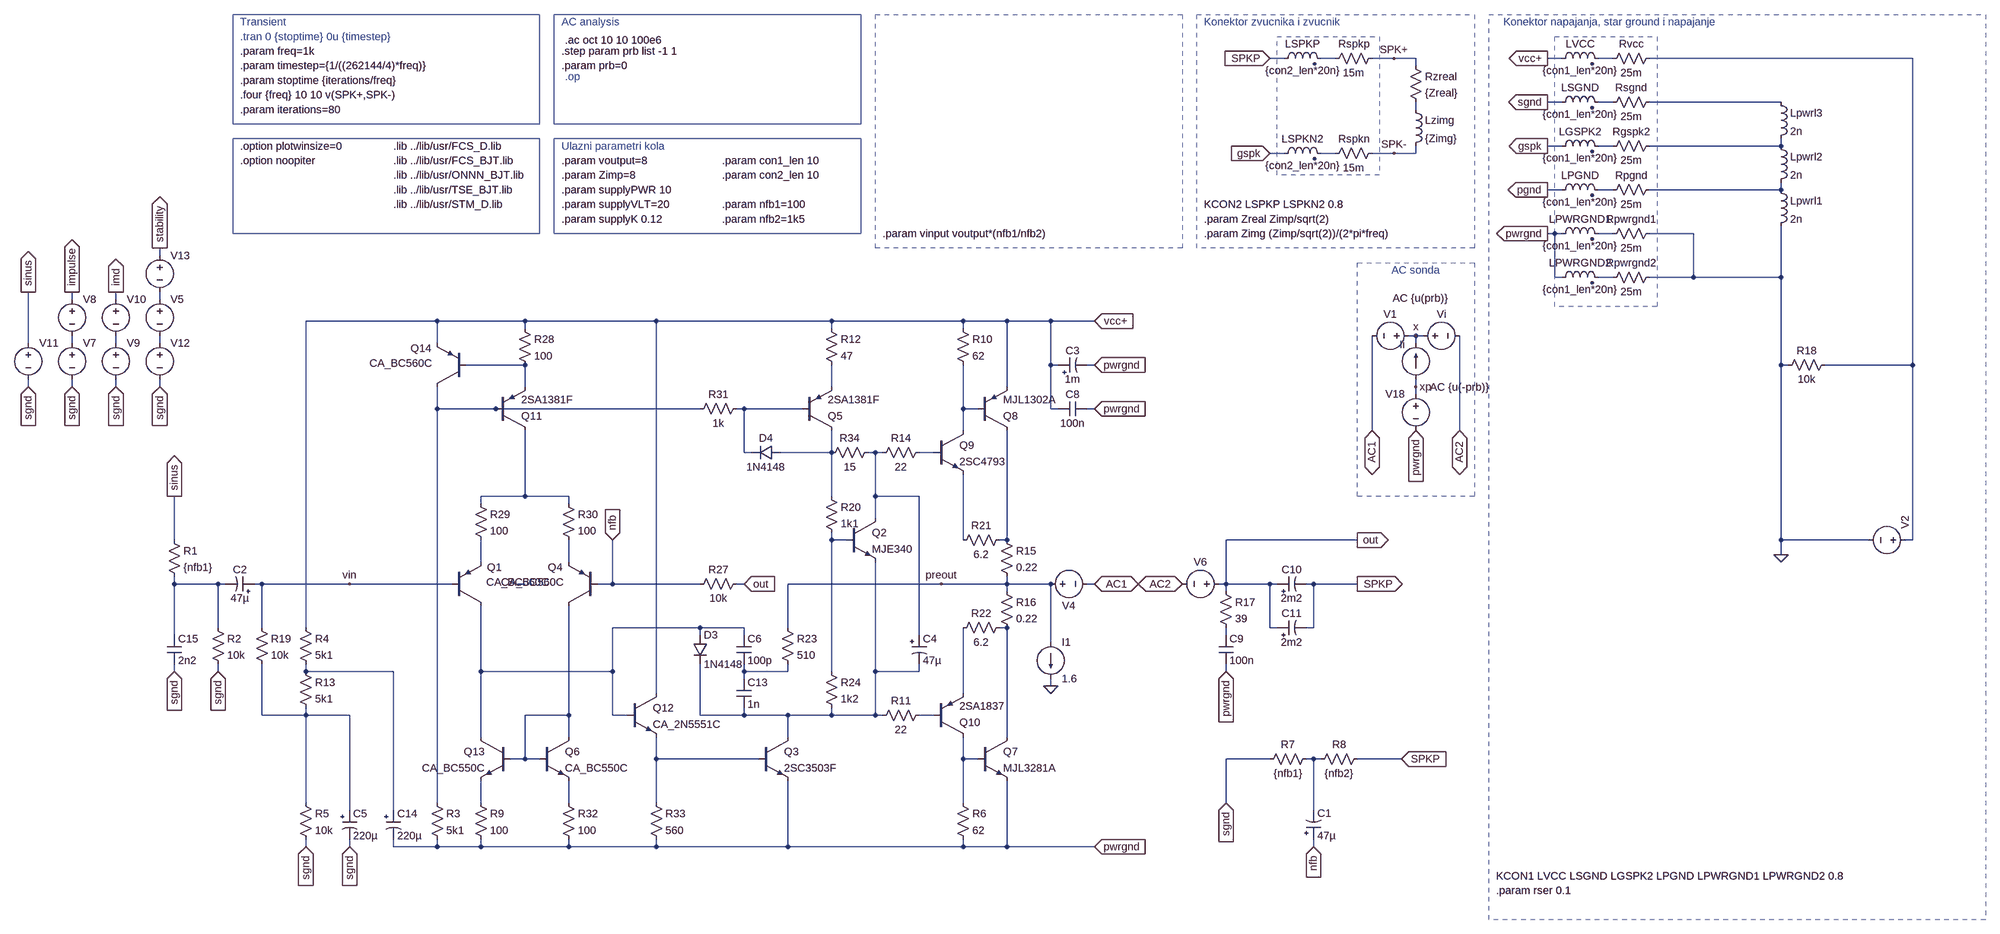
[diagram p0: schematic pab3bbb-compact.asc]
pab3bbb-compact.asc, the LTspice schematic file:
Version 4
SHEET 1 6124 2336
WIRE 2272 -1536 2240 -1536
WIRE 2384 -1536 2352 -1536
WIRE 2512 -1536 2464 -1536
WIRE 2560 -1536 2512 -1536
WIRE 2880 -1536 2848 -1536
WIRE 2992 -1536 2960 -1536
WIRE 3648 -1536 3072 -1536
WIRE 2560 -1520 2560 -1536
WIRE 2880 -1440 2848 -1440
WIRE 2992 -1440 2960 -1440
WIRE 3360 -1440 3072 -1440
WIRE 2560 -1424 2560 -1440
WIRE 2880 -1344 2848 -1344
WIRE 2992 -1344 2960 -1344
WIRE 3360 -1344 3360 -1360
WIRE 3360 -1344 3072 -1344
WIRE 2272 -1328 2240 -1328
WIRE 2384 -1328 2352 -1328
WIRE 2512 -1328 2464 -1328
WIRE 2560 -1328 2560 -1344
WIRE 2560 -1328 2512 -1328
WIRE 2880 -1248 2848 -1248
WIRE 2992 -1248 2960 -1248
WIRE 3360 -1248 3360 -1264
WIRE 3360 -1248 3072 -1248
WIRE 2864 -1152 2848 -1152
WIRE 2880 -1152 2864 -1152
WIRE 2992 -1152 2960 -1152
WIRE 3168 -1152 3072 -1152
WIRE -192 -1104 -192 -1120
WIRE 2864 -1056 2864 -1152
WIRE 2880 -1056 2864 -1056
WIRE 2992 -1056 2960 -1056
WIRE 3168 -1056 3168 -1152
WIRE 3168 -1056 3072 -1056
WIRE 3360 -1056 3360 -1168
WIRE 3360 -1056 3168 -1056
WIRE -384 -1008 -384 -1024
WIRE -288 -1008 -288 -1024
WIRE -192 -1008 -192 -1024
WIRE 416 -960 128 -960
WIRE 608 -960 416 -960
WIRE 896 -960 608 -960
WIRE 1280 -960 896 -960
WIRE 1568 -960 1280 -960
WIRE 1664 -960 1568 -960
WIRE 1760 -960 1664 -960
WIRE 1856 -960 1760 -960
WIRE 608 -944 608 -960
WIRE 1280 -944 1280 -960
WIRE 1568 -944 1568 -960
WIRE 2560 -928 2544 -928
WIRE 2576 -928 2560 -928
WIRE -480 -912 -480 -1024
WIRE -384 -912 -384 -928
WIRE -288 -912 -288 -928
WIRE -192 -912 -192 -928
WIRE 416 -912 416 -960
WIRE 2560 -912 2560 -928
WIRE 608 -864 480 -864
WIRE 1760 -864 1760 -960
WIRE 1776 -864 1760 -864
WIRE 1856 -864 1840 -864
WIRE 3360 -864 3360 -1056
WIRE 3376 -864 3360 -864
WIRE 3648 -864 3648 -1536
WIRE 3648 -864 3456 -864
WIRE -480 -816 -480 -832
WIRE -384 -816 -384 -832
WIRE -288 -816 -288 -832
WIRE -192 -816 -192 -832
WIRE 608 -816 608 -864
WIRE 1280 -816 1280 -864
WIRE 1664 -816 1664 -960
WIRE 2560 -816 2560 -832
WIRE 2560 -800 2560 -816
WIRE 416 -768 416 -816
WIRE 544 -768 416 -768
WIRE 992 -768 544 -768
WIRE 1088 -768 1072 -768
WIRE 1216 -768 1088 -768
WIRE 1568 -768 1568 -864
WIRE 1600 -768 1568 -768
WIRE 1760 -768 1760 -864
WIRE 1776 -768 1760 -768
WIRE 1856 -768 1840 -768
WIRE 1568 -720 1568 -768
WIRE 2464 -720 2464 -928
WIRE 2656 -720 2656 -928
WIRE 1088 -672 1088 -768
WIRE 1104 -672 1088 -672
WIRE 1280 -672 1280 -720
WIRE 1280 -672 1168 -672
WIRE 1376 -672 1360 -672
WIRE 1392 -672 1376 -672
WIRE 1504 -672 1472 -672
WIRE 608 -576 608 -720
WIRE 608 -576 512 -576
WIRE 704 -576 608 -576
WIRE 1280 -576 1280 -672
WIRE 1376 -576 1376 -672
WIRE 1472 -576 1376 -576
WIRE 512 -560 512 -576
WIRE 704 -560 704 -576
WIRE 1376 -528 1376 -576
WIRE -160 -480 -160 -576
WIRE 1280 -480 1280 -496
WIRE 1312 -480 1280 -480
WIRE 1568 -480 1568 -624
WIRE 1664 -480 1664 -720
WIRE 1664 -480 1648 -480
WIRE 2432 -480 2144 -480
WIRE 3360 -480 3360 -864
WIRE 3552 -480 3360 -480
WIRE 3648 -480 3648 -864
WIRE 3648 -480 3632 -480
WIRE 3360 -448 3360 -480
WIRE 512 -432 512 -480
WIRE 704 -432 704 -480
WIRE -160 -384 -160 -400
WIRE -64 -384 -160 -384
WIRE -48 -384 -64 -384
WIRE 32 -384 16 -384
WIRE 224 -384 32 -384
WIRE 448 -384 224 -384
WIRE 608 -384 592 -384
WIRE 800 -384 800 -480
WIRE 800 -384 768 -384
WIRE 992 -384 800 -384
WIRE 1088 -384 1072 -384
WIRE 1520 -384 1184 -384
WIRE 1664 -384 1664 -400
WIRE 1664 -384 1520 -384
WIRE 1760 -384 1664 -384
WIRE 1856 -384 1840 -384
WIRE 2144 -384 2144 -480
WIRE 2144 -384 2128 -384
WIRE 2240 -384 2144 -384
WIRE 2256 -384 2240 -384
WIRE 2336 -384 2320 -384
WIRE 2432 -384 2336 -384
WIRE 1664 -368 1664 -384
WIRE 2144 -368 2144 -384
WIRE -64 -288 -64 -384
WIRE 32 -288 32 -384
WIRE 128 -288 128 -960
WIRE 992 -288 800 -288
WIRE 1088 -288 992 -288
WIRE 1184 -288 1184 -384
WIRE 1664 -288 1648 -288
WIRE 2240 -288 2240 -384
WIRE 2256 -288 2240 -288
WIRE 2336 -288 2336 -384
WIRE 2336 -288 2320 -288
WIRE -160 -272 -160 -384
WIRE 992 -272 992 -288
WIRE 1088 -272 1088 -288
WIRE 1472 -272 1472 -576
WIRE 2144 -272 2144 -288
WIRE 1760 -256 1760 -384
WIRE -160 -192 -160 -208
WIRE -64 -192 -64 -208
WIRE 128 -192 128 -208
WIRE 320 -192 128 -192
WIRE 512 -192 512 -336
WIRE 800 -192 800 -288
WIRE 800 -192 512 -192
WIRE 1088 -192 1088 -208
WIRE 1184 -192 1184 -208
WIRE 1184 -192 1088 -192
WIRE 1280 -192 1280 -480
WIRE 1376 -192 1376 -432
WIRE 1472 -192 1472 -208
WIRE 1472 -192 1376 -192
WIRE 2144 -192 2144 -208
WIRE 1088 -176 1088 -192
WIRE 1760 -160 1760 -176
WIRE 896 -144 896 -960
WIRE 1568 -144 1568 -288
WIRE 32 -96 32 -208
WIRE 128 -96 128 -112
WIRE 128 -96 32 -96
WIRE 224 -96 128 -96
WIRE 704 -96 704 -336
WIRE 704 -96 608 -96
WIRE 800 -96 800 -192
WIRE 832 -96 800 -96
WIRE 992 -96 992 -208
WIRE 1088 -96 1088 -112
WIRE 1088 -96 992 -96
WIRE 1184 -96 1088 -96
WIRE 1280 -96 1280 -112
WIRE 1280 -96 1184 -96
WIRE 1376 -96 1376 -192
WIRE 1376 -96 1280 -96
WIRE 1392 -96 1376 -96
WIRE 1504 -96 1472 -96
WIRE 512 -48 512 -192
WIRE 704 -48 704 -96
WIRE 1184 -48 1184 -96
WIRE 1664 -48 1664 -288
WIRE 608 0 608 -96
WIRE 608 0 576 0
WIRE 640 0 608 0
WIRE 896 0 896 -48
WIRE 1120 0 896 0
WIRE 1568 0 1568 -48
WIRE 1600 0 1568 0
WIRE 2240 0 2144 0
WIRE 2336 0 2320 0
WIRE 2352 0 2336 0
WIRE 2528 0 2432 0
WIRE 128 96 128 -96
WIRE 416 96 416 -768
WIRE 512 96 512 48
WIRE 704 96 704 48
WIRE 896 96 896 0
WIRE 1568 96 1568 0
WIRE 2144 96 2144 0
WIRE 224 112 224 -96
WIRE 320 112 320 -192
WIRE 2336 112 2336 0
WIRE 128 192 128 176
WIRE 224 192 224 176
WIRE 320 192 320 176
WIRE 416 192 416 176
WIRE 416 192 320 192
WIRE 512 192 512 176
WIRE 512 192 416 192
WIRE 704 192 704 176
WIRE 704 192 512 192
WIRE 896 192 896 176
WIRE 896 192 704 192
WIRE 1184 192 1184 48
WIRE 1184 192 896 192
WIRE 1568 192 1568 176
WIRE 1568 192 1184 192
WIRE 1664 192 1664 48
WIRE 1664 192 1568 192
WIRE 1856 192 1664 192
WIRE 2336 192 2336 176
FLAG 1856 -960 vcc+
IOPIN 1856 -960 In
FLAG 2560 -928 x
FLAG 2432 -480 out
IOPIN 2432 -480 Out
FLAG 2560 -816 xp
FLAG 2144 -192 pwrgnd
IOPIN 2144 -192 In
FLAG -480 -816 sgnd
IOPIN -480 -816 In
FLAG -480 -1024 sinus
IOPIN -480 -1024 Out
FLAG 2848 -1536 vcc+
IOPIN 2848 -1536 Out
FLAG 2848 -1344 gspk
IOPIN 2848 -1344 Out
FLAG 2848 -1248 pgnd
IOPIN 2848 -1248 Out
FLAG 2848 -1440 sgnd
IOPIN 2848 -1440 Out
FLAG 2432 -384 SPKP
IOPIN 2432 -384 Out
FLAG 2240 -1328 gspk
IOPIN 2240 -1328 In
FLAG 2240 -1536 SPKP
IOPIN 2240 -1536 In
FLAG 2848 -1152 pwrgnd
IOPIN 2848 -1152 Out
FLAG 3360 -448 0
FLAG 2464 -720 AC1
IOPIN 2464 -720 BiDir
FLAG 2656 -720 AC2
IOPIN 2656 -720 BiDir
FLAG 1856 -384 AC1
IOPIN 1856 -384 BiDir
FLAG 2048 -384 AC2
IOPIN 2048 -384 BiDir
FLAG 2560 -720 pwrgnd
IOPIN 2560 -720 In
FLAG 2512 -1536 SPK+
FLAG 2512 -1328 SPK-
FLAG -288 -1024 imd
IOPIN -288 -1024 Out
FLAG 1856 -768 pwrgnd
IOPIN 1856 -768 In
FLAG -384 -816 sgnd
IOPIN -384 -816 In
FLAG -288 -816 sgnd
IOPIN -288 -816 In
FLAG 1520 -384 preout
FLAG -64 -192 sgnd
IOPIN -64 -192 In
FLAG 1856 -864 pwrgnd
IOPIN 1856 -864 In
FLAG -192 -1120 stability
IOPIN -192 -1120 Out
FLAG -192 -816 sgnd
IOPIN -192 -816 In
FLAG 1856 192 pwrgnd
IOPIN 1856 192 In
FLAG -160 -192 sgnd
IOPIN -160 -192 In
FLAG 2144 96 sgnd
IOPIN 2144 96 In
FLAG -384 -1024 impulse
IOPIN -384 -1024 Out
FLAG 224 -384 vin
FLAG 2528 0 SPKP
IOPIN 2528 0 In
FLAG 1088 -384 out
IOPIN 1088 -384 In
FLAG -160 -576 sinus
IOPIN -160 -576 Out
FLAG 2336 192 nfb
IOPIN 2336 192 In
FLAG 800 -480 nfb
IOPIN 800 -480 In
FLAG 128 192 sgnd
IOPIN 128 192 In
FLAG 224 192 sgnd
IOPIN 224 192 In
FLAG 1760 -160 0
DATAFLAG 1488 -960 ""
DATAFLAG 1760 192 ""
DATAFLAG 1712 -384 ""
SYMBOL res 2224 16 R270
WINDOW 0 32 56 VTop 2
WINDOW 3 0 56 VBottom 2
SYMATTR InstName R7
SYMATTR Value {nfb1}
SYMBOL current 2560 -832 R180
WINDOW 0 24 77 Left 2
WINDOW 3 24 0 Invisible 2
WINDOW 123 -71 178 Left 2
WINDOW 39 0 0 Left 2
SYMATTR InstName Ii
SYMATTR Value 0
SYMATTR Value2 AC {u(prb)}
SYMBOL voltage 2560 -928 R270
WINDOW 0 32 56 VTop 2
WINDOW 3 -32 56 Invisible 2
WINDOW 123 -97 96 VBottom 2
WINDOW 39 -32 56 VBottom 2
SYMATTR InstName Vi
SYMATTR Value 0
SYMATTR Value2 AC {u(-prb)}
SYMBOL pnp 448 -336 M180
WINDOW 0 77 84 Left 2
WINDOW 3 75 52 Left 2
SYMATTR InstName Q1
SYMATTR Value CA_BC560C
SYMBOL res 496 80 R0
SYMATTR InstName R9
SYMATTR Value 100
SYMBOL res 2448 -16 R90
WINDOW 0 0 56 VBottom 2
WINDOW 3 32 56 VTop 2
SYMATTR InstName R8
SYMATTR Value {nfb2}
SYMBOL voltage 2560 -928 R90
WINDOW 0 -32 56 VBottom 2
WINDOW 3 32 56 Invisible 2
WINDOW 123 0 0 Left 2
WINDOW 39 0 0 Left 2
SYMATTR InstName V1
SYMATTR Value 0
SYMBOL res 2128 -384 R0
SYMATTR InstName R17
SYMATTR Value 39
SYMBOL res 2544 -1536 R0
SYMATTR InstName Rzreal
SYMATTR Value {Zreal}
SYMBOL ind 2544 -1440 R0
SYMATTR InstName Lzimg
SYMATTR Value {Zimg}
SYMATTR SpiceLine Cpar=10p
SYMBOL voltage 2560 -816 M0
WINDOW 123 0 0 Left 2
WINDOW 39 0 0 Left 2
WINDOW 3 24 96 Invisible 2
SYMATTR Value 0
SYMATTR InstName V18
SYMBOL cap 1776 -784 M90
WINDOW 0 0 32 VBottom 2
WINDOW 3 32 32 VTop 2
SYMATTR InstName C8
SYMATTR Value 100n
SYMATTR SpiceLine Rser=300m Lser=3n Rpar=4.4meg Cpar=1p
SYMBOL cap 2128 -272 R0
SYMATTR InstName C9
SYMATTR Value 100n
SYMATTR SpiceLine Rser=700m Lser=7n Rpar=4.4meg Cpar=1p
SYMBOL ind2 2864 -1520 R270
WINDOW 0 32 56 VTop 2
WINDOW 3 5 56 VBottom 2
SYMATTR InstName LVCC
SYMATTR Value {con1_len*20n}
SYMATTR SpiceLine Rser={con1_len*.5m}
SYMATTR Type ind
SYMBOL voltage -480 -928 R0
WINDOW 123 24 44 Left 2
WINDOW 39 0 0 Left 2
WINDOW 3 24 96 Invisible 2
SYMATTR Value SINE(0 {vinput} {freq} 0 0 0)
SYMATTR InstName V11
SYMBOL ind2 2864 -1328 R270
WINDOW 0 32 56 VTop 2
WINDOW 3 5 56 VBottom 2
SYMATTR InstName LGSPK2
SYMATTR Value {con1_len*20n}
SYMATTR SpiceLine Rser={con1_len*.5m}
SYMATTR Type ind
SYMBOL ind2 2864 -1040 R270
WINDOW 0 32 56 VTop 2
WINDOW 3 5 56 VBottom 2
SYMATTR InstName LPWRGND2
SYMATTR Value {con1_len*20n}
SYMATTR SpiceLine Rser={con1_len*.5m}
SYMATTR Type ind
SYMBOL ind2 2864 -1232 R270
WINDOW 0 32 56 VTop 2
WINDOW 3 5 56 VBottom 2
SYMATTR InstName LPGND
SYMATTR Value {con1_len*20n}
SYMATTR SpiceLine Rser={con1_len*.5m}
SYMATTR Type ind
SYMBOL ind2 2864 -1424 R270
WINDOW 0 32 56 VTop 2
WINDOW 3 5 56 VBottom 2
SYMATTR InstName LSGND
SYMATTR Value {con1_len*20n}
SYMATTR SpiceLine Rser={con1_len*.5m}
SYMATTR Type ind
SYMBOL res 3088 -1552 R90
WINDOW 0 0 56 VBottom 2
WINDOW 3 32 56 VTop 2
SYMATTR InstName Rvcc
SYMATTR Value 25m
SYMBOL res 3088 -1360 R90
WINDOW 0 0 56 VBottom 2
WINDOW 3 32 56 VTop 2
SYMATTR InstName Rgspk2
SYMATTR Value 25m
SYMBOL res 3088 -1072 R90
WINDOW 0 0 56 VBottom 2
WINDOW 3 32 56 VTop 2
SYMATTR InstName Rpwrgnd2
SYMATTR Value 25m
SYMBOL res 3088 -1264 R90
WINDOW 0 0 56 VBottom 2
WINDOW 3 32 56 VTop 2
SYMATTR InstName Rpgnd
SYMATTR Value 25m
SYMBOL res 3088 -1456 R90
WINDOW 0 0 56 VBottom 2
WINDOW 3 32 56 VTop 2
SYMATTR InstName Rsgnd
SYMATTR Value 25m
SYMBOL ind 3344 -1264 R0
SYMATTR InstName Lpwrl1
SYMATTR Value 2n
SYMATTR SpiceLine Rser=1m
SYMBOL ind 3344 -1360 R0
SYMATTR InstName Lpwrl2
SYMATTR Value 2n
SYMATTR SpiceLine Rser=1m
SYMBOL ind 3344 -1456 R0
SYMATTR InstName Lpwrl3
SYMATTR Value 2n
SYMATTR SpiceLine Rser=1m
SYMBOL ind2 2256 -1520 R270
WINDOW 0 32 56 VTop 2
WINDOW 3 5 56 VBottom 2
SYMATTR InstName LSPKP
SYMATTR Value {con2_len*20n}
SYMATTR SpiceLine Rser={con2_len*.5m}
SYMATTR Type ind
SYMBOL ind2 2256 -1312 R270
WINDOW 0 32 56 VTop 2
WINDOW 3 5 56 VBottom 2
SYMATTR InstName LSPKN2
SYMATTR Value {con2_len*20n}
SYMATTR SpiceLine Rser={con2_len*.5m}
SYMATTR Type ind
SYMBOL res 2480 -1552 R90
WINDOW 0 0 56 VBottom 2
WINDOW 3 32 56 VTop 2
SYMATTR InstName Rspkp
SYMATTR Value 15m
SYMBOL res 2480 -1344 R90
WINDOW 0 0 56 VBottom 2
WINDOW 3 32 56 VTop 2
SYMATTR InstName Rspkn
SYMATTR Value 15m
SYMBOL ind2 2864 -1136 R270
WINDOW 0 32 56 VTop 2
WINDOW 3 5 56 VBottom 2
SYMATTR InstName LPWRGND1
SYMATTR Value {con1_len*20n}
SYMATTR SpiceLine Rser={con1_len*.5m}
SYMATTR Type ind
SYMBOL res 3088 -1168 R90
WINDOW 0 0 56 VBottom 2
WINDOW 3 32 56 VTop 2
SYMATTR InstName Rpwrgnd1
SYMATTR Value 25m
SYMBOL voltage -384 -928 R0
WINDOW 3 24 96 Invisible 2
WINDOW 123 0 0 Left 2
WINDOW 39 0 0 Left 2
SYMATTR Value PULSE(0 {vinput/2} 1u 1n 1n {1/(freq*2)} {1/freq})
SYMATTR InstName V7
SYMBOL voltage -384 -1024 R0
WINDOW 3 24 96 Invisible 2
WINDOW 123 0 0 Left 2
WINDOW 39 0 0 Left 2
SYMATTR Value PULSE(0 {-vinput/2} {1u+(1/(freq*2))} 1n 1n {1/(freq*2)} {1/freq})
SYMATTR InstName V8
SYMBOL polcap 16 -368 M270
WINDOW 3 0 32 VBottom 2
WINDOW 0 32 32 VTop 2
SYMATTR Value 47µ
SYMATTR InstName C2
SYMATTR SpiceLine V=6.3 Irms=290m Rser=0.5 Lser=3n Rpar=2100k Cpar=3p
SYMATTR Description Capacitor
SYMATTR Type cap
SYMBOL voltage 1744 -384 R270
WINDOW 0 -32 56 VBottom 2
WINDOW 3 32 56 Invisible 2
WINDOW 123 0 0 Left 2
WINDOW 39 0 0 Left 2
SYMATTR InstName V4
SYMATTR Value 0
SYMBOL voltage 2144 -384 R90
WINDOW 0 -32 56 VBottom 2
WINDOW 3 32 56 Invisible 2
WINDOW 123 0 0 Left 2
WINDOW 39 0 0 Left 2
SYMATTR InstName V6
SYMATTR Value 0
SYMBOL voltage -288 -928 R0
WINDOW 3 24 96 Invisible 2
WINDOW 123 0 0 Left 2
WINDOW 39 0 0 Left 2
SYMATTR Value SINE(0 {vinput/2} 19k)
SYMATTR InstName V9
SYMBOL voltage -288 -1024 R0
WINDOW 3 24 96 Invisible 2
WINDOW 123 0 0 Left 2
WINDOW 39 0 0 Left 2
SYMATTR Value SINE(0 {vinput/2} 20k 0 0)
SYMATTR InstName V10
SYMBOL res 1648 -384 R0
SYMATTR InstName R16
SYMATTR Value 0.22
SYMBOL res 1648 -496 R0
SYMATTR InstName R15
SYMATTR Value 0.22
SYMBOL npn 1120 -48 R0
SYMATTR InstName Q3
SYMATTR Value 2SC3503F
SYMBOL cap 1072 -272 R0
SYMATTR InstName C6
SYMATTR Value 100p
SYMATTR SpiceLine Rser=.3 Lser=6n Rpar=3.9meg Cpar=1p
SYMBOL res 3472 -880 R90
WINDOW 0 0 56 VBottom 2
WINDOW 3 32 56 VTop 2
SYMATTR InstName R18
SYMATTR Value 10k
SYMBOL voltage -192 -1120 R0
WINDOW 123 24 44 Left 2
WINDOW 39 0 0 Left 2
WINDOW 3 24 96 Invisible 2
SYMATTR Value SINE(0 {7*vinput/8} {freq} 0 0 0)
SYMATTR InstName V13
SYMBOL voltage -192 -1024 R0
WINDOW 3 24 96 Invisible 2
WINDOW 123 0 0 Left 2
WINDOW 39 0 0 Left 2
SYMATTR Value PULSE(0 {-vinput/8} {1u+(1/(freq*80))} 1n 1n {1/(freq*80)} {1/(freq*40)})
SYMATTR InstName V5
SYMBOL voltage -192 -928 R0
WINDOW 3 24 96 Invisible 2
WINDOW 123 0 0 Left 2
WINDOW 39 0 0 Left 2
SYMATTR Value PULSE(0 {vinput/8} 1u 1n 1n {1/(freq*80)} {1/(freq*40)})
SYMATTR InstName V12
SYMBOL res 1264 -960 R0
SYMATTR InstName R12
SYMATTR Value 47
SYMBOL res 1488 -688 R90
WINDOW 0 0 56 VBottom 2
WINDOW 3 32 56 VTop 2
SYMATTR InstName R14
SYMATTR Value 22
SYMBOL res 1488 -112 R90
WINDOW 0 0 56 VBottom 2
WINDOW 3 32 56 VTop 2
SYMATTR InstName R11
SYMATTR Value 22
SYMBOL voltage 3648 -480 M270
WINDOW 123 24 -12 Left 2
WINDOW 3 24 -12 Invisible 2
SYMATTR Value {supplyVLT}
SYMATTR SpiceLine Rser={rser}
SYMATTR InstName V2
SYMBOL polcap 2256 -368 R270
WINDOW 0 32 32 VTop 2
WINDOW 3 0 32 VBottom 2
SYMATTR InstName C10
SYMATTR Value 2m2
SYMATTR SpiceLine V=63 Irms=1.44 Rser=0.09 Lser=5.5n Rpar=3310k Cpar=3p
SYMATTR Description Capacitor
SYMATTR Type cap
SYMBOL res 112 80 R0
SYMATTR InstName R5
SYMATTR Value 10k
SYMBOL res 112 -304 R0
SYMATTR InstName R4
SYMATTR Value 5k1
SYMBOL res -80 -304 R0
SYMATTR InstName R2
SYMATTR Value 10k
SYMBOL polcap 2256 -272 R270
WINDOW 0 32 32 VTop 2
WINDOW 3 0 32 VBottom 2
SYMATTR InstName C11
SYMATTR Value 2m2
SYMATTR SpiceLine V=63 Irms=1.44 Rser=0.09 Lser=5.5n Rpar=3310k Cpar=3p
SYMATTR Description Capacitor
SYMATTR Type cap
SYMBOL res 1552 80 R0
SYMATTR InstName R6
SYMATTR Value 62
SYMBOL res 1552 -960 R0
SYMATTR InstName R10
SYMATTR Value 62
SYMBOL npn 1600 -48 R0
SYMATTR InstName Q7
SYMATTR Value MJL3281A
SYMBOL pnp 1600 -720 M180
SYMATTR InstName Q8
SYMATTR Value MJL1302A
SYMBOL npn 1504 -720 R0
SYMATTR InstName Q9
SYMATTR Value 2SC4793
SYMBOL pnp 1504 -48 M180
SYMATTR InstName Q10
SYMATTR Value 2SA1837
SYMBOL npn 1312 -528 R0
SYMATTR InstName Q2
SYMATTR Value MJE340
SYMBOL res 1264 -592 R0
SYMATTR InstName R20
SYMATTR Value 1k1
SYMBOL res 1264 -208 R0
SYMATTR InstName R24
SYMATTR Value 1k2
SYMBOL polcap 1456 -272 R0
SYMATTR Value 47µ
SYMATTR InstName C4
SYMATTR SpiceLine V=6.3 Irms=290m Rser=0.5 Lser=3n Rpar=2100k Cpar=3p
SYMATTR Description Capacitor
SYMATTR Type cap
SYMBOL res 1664 -496 R90
WINDOW 0 0 56 VBottom 2
WINDOW 3 32 56 VTop 2
SYMATTR InstName R21
SYMATTR Value 6.2
SYMBOL res 1664 -304 R90
WINDOW 0 0 56 VBottom 2
WINDOW 3 32 56 VTop 2
SYMATTR InstName R22
SYMATTR Value 6.2
SYMBOL pnp 1216 -720 M180
SYMATTR InstName Q5
SYMATTR Value 2SA1381F
SYMBOL polcap 208 112 R0
SYMATTR InstName C5
SYMATTR Value 220µ
SYMATTR SpiceLine V=6.3 Irms=1.44 Rser=0.09 Lser=5.5n Rpar=3310k Cpar=3p
SYMATTR Description Capacitor
SYMATTR Type cap
SYMBOL res 112 -208 R0
SYMATTR InstName R13
SYMATTR Value 5k1
SYMBOL polcap 304 112 R0
SYMATTR InstName C14
SYMATTR Value 220µ
SYMATTR SpiceLine V=6.3 Irms=1.44 Rser=0.09 Lser=5.5n Rpar=3310k Cpar=3p
SYMATTR Description Capacitor
SYMATTR Type cap
SYMBOL cap -176 -272 R0
SYMATTR InstName C15
SYMATTR Value 2n2
SYMATTR SpiceLine Rser=.3 Lser=6n Rpar=3.9meg Cpar=1p
SYMBOL pnp 768 -336 R180
WINDOW 0 77 84 Left 2
WINDOW 3 75 52 Left 2
SYMATTR InstName Q4
SYMATTR Value CA_BC560C
SYMBOL pnp 544 -720 M180
SYMATTR InstName Q11
SYMATTR Value 2SA1381F
SYMBOL res 592 -960 R0
SYMATTR InstName R28
SYMATTR Value 100
SYMBOL res 496 -576 R0
SYMATTR InstName R29
SYMATTR Value 100
SYMBOL res 688 -576 R0
SYMATTR InstName R30
SYMATTR Value 100
SYMBOL res 400 80 R0
SYMATTR InstName R3
SYMATTR Value 5k1
SYMBOL res 688 80 R0
SYMATTR InstName R32
SYMATTR Value 100
SYMBOL npn 832 -144 R0
SYMATTR InstName Q12
SYMATTR Value CA_2N5551C
SYMBOL res 880 80 R0
SYMATTR InstName R33
SYMATTR Value 560
SYMBOL res 1376 -688 R90
WINDOW 0 0 56 VBottom 2
WINDOW 3 32 56 VTop 2
SYMATTR InstName R34
SYMATTR Value 15
SYMBOL res -176 -496 R0
SYMATTR InstName R1
SYMATTR Value {nfb1}
SYMBOL res 16 -304 R0
SYMATTR InstName R19
SYMATTR Value 10k
SYMBOL res 1088 -400 R90
WINDOW 0 0 56 VBottom 2
WINDOW 3 32 56 VTop 2
SYMATTR InstName R27
SYMATTR Value 10k
SYMBOL res 1088 -784 R90
WINDOW 0 0 56 VBottom 2
WINDOW 3 32 56 VTop 2
SYMATTR InstName R31
SYMATTR Value 1k
SYMBOL npn 640 -48 R0
SYMATTR InstName Q6
SYMATTR Value CA_BC550C
SYMBOL npn 576 -48 M0
SYMATTR InstName Q13
SYMATTR Value CA_BC550C
SYMBOL diode 976 -272 R0
SYMATTR InstName D3
SYMATTR Value 1N4148
SYMBOL diode 1168 -688 R90
WINDOW 0 0 32 VBottom 2
WINDOW 3 32 32 VTop 2
SYMATTR InstName D4
SYMATTR Value 1N4148
SYMBOL cap 1072 -176 R0
SYMATTR InstName C13
SYMATTR Value 1n
SYMATTR SpiceLine Rser=.3 Lser=6n Rpar=3.9meg Cpar=1p
SYMBOL res 1168 -304 R0
SYMATTR InstName R23
SYMATTR Value 510
SYMBOL polcap 2320 176 M180
WINDOW 3 24 8 Left 2
WINDOW 0 24 57 Left 2
SYMATTR Value 47µ
SYMATTR InstName C1
SYMATTR SpiceLine V=6.3 Irms=290m Rser=0.5 Lser=3n Rpar=2100k Cpar=3p
SYMATTR Description Capacitor
SYMATTR Type cap
SYMBOL polcap 1776 -848 R270
WINDOW 0 32 32 VTop 2
WINDOW 3 0 32 VBottom 2
SYMATTR InstName C3
SYMATTR Value 1m
SYMATTR SpiceLine V=100 Irms=1.44 Rser=0.09 Lser=5.5n Rpar=3310k Cpar=3p
SYMATTR Description Capacitor
SYMATTR Type cap
SYMBOL pnp 480 -816 R180
WINDOW 0 77 84 Left 2
WINDOW 3 75 52 Left 2
SYMATTR InstName Q14
SYMATTR Value CA_BC560C
SYMBOL current 1760 -256 R0
WINDOW 123 0 0 Left 2
WINDOW 39 0 0 Left 2
SYMATTR InstName I1
SYMATTR Value 1.6
TEXT -16 -1344 Left 2 !.option plotwinsize=0
TEXT -16 -1312 Left 2 !.option noopiter
TEXT -16 -1616 Left 2 ;Transient
TEXT -16 -1456 Left 2 !.four {freq} 10 10 v(SPK+,SPK-)
TEXT 688 -1520 Left 2 !.param prb=0
TEXT -16 -1520 Left 2 !.param timestep={1/((262144/4)*freq)}
TEXT -16 -1552 Left 2 !.param freq=1k
TEXT -16 -1488 Left 2 !.param stoptime {iterations/freq}
TEXT 688 -1552 Left 2 !.step param prb list -1 1
TEXT 688 -1616 Left 2 ;AC analysis
TEXT -16 -1424 Left 2 !.param iterations=80
TEXT 320 -1280 Left 2 !.lib ../lib/usr/ONNN_BJT.lib
TEXT 688 -1280 Left 2 !.param Zimp=8
TEXT 2096 -1184 Left 2 !.param Zreal Zimp/sqrt(2)
TEXT 2096 -1152 Left 2 !.param Zimg (Zimp/sqrt(2))/(2*pi*freq)
TEXT 688 -1248 Left 2 !.param supplyPWR 10
TEXT 688 -1216 Left 2 !.param supplyVLT=20
TEXT 320 -1216 Left 2 !.lib ../lib/usr/STM_D.lib
TEXT 320 -1312 Left 2 !.lib ../lib/usr/FCS_BJT.lib
TEXT 688 -1312 Left 2 !.param voutput=8
TEXT 688 -1184 Left 2 !.param supplyK 0.12
TEXT 2736 288 Left 2 !.param rser 0.1
TEXT -16 -1584 Left 2 ;.tran 0 {stoptime} 0u {timestep}
TEXT 1040 -1312 Left 2 !.param con1_len 10
TEXT 2736 256 Left 2 !KCON1 LVCC LSGND LGSPK2 LPGND LPWRGND1 LPWRGND2 0.8
TEXT 1040 -1280 Left 2 !.param con2_len 10
TEXT 2096 -1216 Left 2 !KCON2 LSPKP LSPKN2 0.8
TEXT 2096 -1616 Left 2 ;Konektor zvucnika i zvucnik
TEXT 2752 -1616 Left 2 ;Konektor napajanja, star ground i napajanje
TEXT 688 -1344 Left 2 ;Ulazni parametri kola
TEXT 2560 -1072 Center 2 ;AC sonda
TEXT 320 -1344 Left 2 !.lib ../lib/usr/FCS_D.lib
TEXT 1392 -1152 Left 2 !.param vinput voutput*(nfb1/nfb2)
TEXT 1040 -1216 Left 2 !.param nfb1=100
TEXT 1040 -1184 Left 2 !.param nfb2=1k5
TEXT 696 -1496 Left 2 ;.op
TEXT 696 -1576 Left 2 !.ac oct 10 10 100e6
TEXT 320 -1248 Left 2 !.lib ../lib/usr/TSE_BJT.lib
RECTANGLE Normal 640 -1632 -32 -1392
RECTANGLE Normal 640 -1152 -32 -1360
RECTANGLE Normal 1344 -1632 672 -1392
RECTANGLE Normal 2688 -1120 2080 -1632 2
RECTANGLE Normal 2688 -576 2432 -1088 2
RECTANGLE Normal 3088 -992 2864 -1584 2
RECTANGLE Normal 2480 -1280 2256 -1584 2
RECTANGLE Normal 2048 -1120 1376 -1632 2
RECTANGLE Normal 1344 -1360 672 -1152
RECTANGLE Normal 3808 352 2720 -1632 2

The netlist it stands for:
* pab3bbb-compact.asc
R7 sgnd N046 {nfb1}
Ii xp x 0 AC {u(prb)}
Vi x AC2 0 AC {u(-prb)}
Q1 N034 vin N030 0 CA_BC560C
R9 N047 pwrgnd 100
R8 SPKP N046 {nfb2}
V1 x AC1 0
R17 out N036 39
Rzreal SPK+ N006 {Zreal}
Lzimg N006 SPK- {Zimg} Cpar=10p
V18 xp pwrgnd 0
C8 vcc+ pwrgnd 100n Rser=300m Lser=3n Rpar=4.4meg Cpar=1p
C9 N036 pwrgnd 100n Rser=700m Lser=7n Rpar=4.4meg Cpar=1p
LVCC vcc+ N002 {con1_len*20n} Rser={con1_len*.5m}
V11 sinus sgnd SINE(0 {vinput} {freq} 0 0 0)
LGSPK2 gspk N007 {con1_len*20n} Rser={con1_len*.5m}
LPWRGND2 pwrgnd N013 {con1_len*20n} Rser={con1_len*.5m}
LPGND pgnd N010 {con1_len*20n} Rser={con1_len*.5m}
LSGND sgnd N004 {con1_len*20n} Rser={con1_len*.5m}
Rvcc N003 N002 25m
Rgspk2 N008 N007 25m
Rpwrgnd2 0 N013 25m
Rpgnd N011 N010 25m
Rsgnd N005 N004 25m
Lpwrl1 N011 0 2n Rser=1m
Lpwrl2 N008 N011 2n Rser=1m
Lpwrl3 N005 N008 2n Rser=1m
LSPKP SPKP N001 {con2_len*20n} Rser={con2_len*.5m}
LSPKN2 gspk N009 {con2_len*20n} Rser={con2_len*.5m}
Rspkp SPK+ N001 15m
Rspkn SPK- N009 15m
LPWRGND1 pwrgnd N012 {con1_len*20n} Rser={con1_len*.5m}
Rpwrgnd1 0 N012 25m
V7 N015 sgnd PULSE(0 {vinput/2} 1u 1n 1n {1/(freq*2)} {1/freq})
V8 impulse N015 PULSE(0 {-vinput/2} {1u+(1/(freq*2))} 1n 1n {1/(freq*2)} {1/freq})
C2 vin N032 47µ V=6.3 Irms=290m Rser=0.5 Lser=3n Rpar=2100k Cpar=3p
V4 preout AC1 0
V6 out AC2 0
V9 N016 sgnd SINE(0 {vinput/2} 19k)
V10 imd N016 SINE(0 {vinput/2} 20k 0 0)
R16 preout N035 0.22
R15 N029 preout 0.22
Q3 N039 N044 pwrgnd 0 2SC3503F
C6 N034 N038 100p Rser=.3 Lser=6n Rpar=3.9meg Cpar=1p
R18 N003 0 10k
V13 stability N014 SINE(0 {7*vinput/8} {freq} 0 0 0)
V5 N014 N017 PULSE(0 {-vinput/8} {1u+(1/(freq*80))} 1n 1n {1/(freq*80)} {1/(freq*40)})
V12 N017 sgnd PULSE(0 {vinput/8} 1u 1n 1n {1/(freq*80)} {1/(freq*40)})
R12 vcc+ N019 47
R14 N025 N024 22
R11 N043 N039 22
V2 N003 0 {supplyVLT} Rser={rser}
C10 out SPKP 2m2 V=63 Irms=1.44 Rser=0.09 Lser=5.5n Rpar=3310k Cpar=3p
R5 N041 sgnd 10k
R4 vcc+ N037 5k1
R2 N032 sgnd 10k
C11 out SPKP 2m2 V=63 Irms=1.44 Rser=0.09 Lser=5.5n Rpar=3310k Cpar=3p
R6 N045 pwrgnd 62
R10 vcc+ N022 62
Q7 N035 N045 pwrgnd 0 MJL3281A
Q8 N029 N022 vcc+ 0 MJL1302A
Q9 N022 N025 N028 0 2SC4793
Q10 N045 N043 N040 0 2SA1837
Q2 N024 N027 N039 0 MJE340
R20 N023 N027 1k1
R24 N027 N039 1k2
C4 N024 N039 47µ V=6.3 Irms=290m Rser=0.5 Lser=3n Rpar=2100k Cpar=3p
R21 N029 N028 6.2
R22 N035 N040 6.2
Q5 N023 N021 N019 0 2SA1381F
C5 N041 sgnd 220µ V=6.3 Irms=1.44 Rser=0.09 Lser=5.5n Rpar=3310k Cpar=3p
R13 N037 N041 5k1
C14 N037 pwrgnd 220µ V=6.3 Irms=1.44 Rser=0.09 Lser=5.5n Rpar=3310k Cpar=3p
C15 N032 sgnd 2n2 Rser=.3 Lser=6n Rpar=3.9meg Cpar=1p
Q4 N042 nfb N031 0 CA_BC560C
Q11 N026 N020 N018 0 2SA1381F
R28 vcc+ N018 100
R29 N026 N030 100
R30 N026 N031 100
R3 N020 pwrgnd 5k1
R32 N048 pwrgnd 100
Q12 vcc+ N034 N044 0 CA_2N5551C
R33 N044 pwrgnd 560
R34 N024 N023 15
R1 sinus N032 {nfb1}
R19 vin N041 10k
R27 out nfb 10k
R31 N021 N020 1k
Q6 N042 N042 N048 0 CA_BC550C
Q13 N034 N042 N047 0 CA_BC550C
D3 N034 N039 1N4148
D4 N023 N021 1N4148
C13 N038 N039 1n Rser=.3 Lser=6n Rpar=3.9meg Cpar=1p
R23 preout N038 510
C1 nfb N046 47µ V=6.3 Irms=290m Rser=0.5 Lser=3n Rpar=2100k Cpar=3p
C3 vcc+ pwrgnd 1m V=100 Irms=1.44 Rser=0.09 Lser=5.5n Rpar=3310k Cpar=3p
Q14 N020 N018 vcc+ 0 CA_BC560C
I1 preout 0 1.6
.model D D
.lib standard.dio
.model NPN NPN
.model PNP PNP
.lib standard.bjt
.option plotwinsize=0
.option noopiter
* Transient
.four {freq} 10 10 v(SPK+,SPK-)
.param prb=0
.param timestep={1/((262144/4)*freq)}
.param freq=1k
.param stoptime {iterations/freq}
.step param prb list -1 1
* AC analysis
.param iterations=80
.lib ../lib/usr/ONNN_BJT.lib
.param Zimp=8
.param Zreal Zimp/sqrt(2)
.param Zimg (Zimp/sqrt(2))/(2*pi*freq)
.param supplyPWR 10
.param supplyVLT=20
.lib ../lib/usr/STM_D.lib
.lib ../lib/usr/FCS_BJT.lib
.param voutput=8
.param supplyK 0.12
.param rser 0.1
* .tran 0 {stoptime} 0u {timestep}
.param con1_len 10
KCON1 LVCC LSGND LGSPK2 LPGND LPWRGND1 LPWRGND2 0.8
.param con2_len 10
KCON2 LSPKP LSPKN2 0.8
* Konektor zvucnika i zvucnik
* Konektor napajanja, star ground i napajanje
* Ulazni parametri kola
* AC sonda
.lib ../lib/usr/FCS_D.lib
.param vinput voutput*(nfb1/nfb2)
.param nfb1=100
.param nfb2=1k5
* .op
.ac oct 10 10 100e6
.lib ../lib/usr/TSE_BJT.lib
.backanno
.end